# Altium project 8x8 Neopixel Matrix V2.PrjPcb
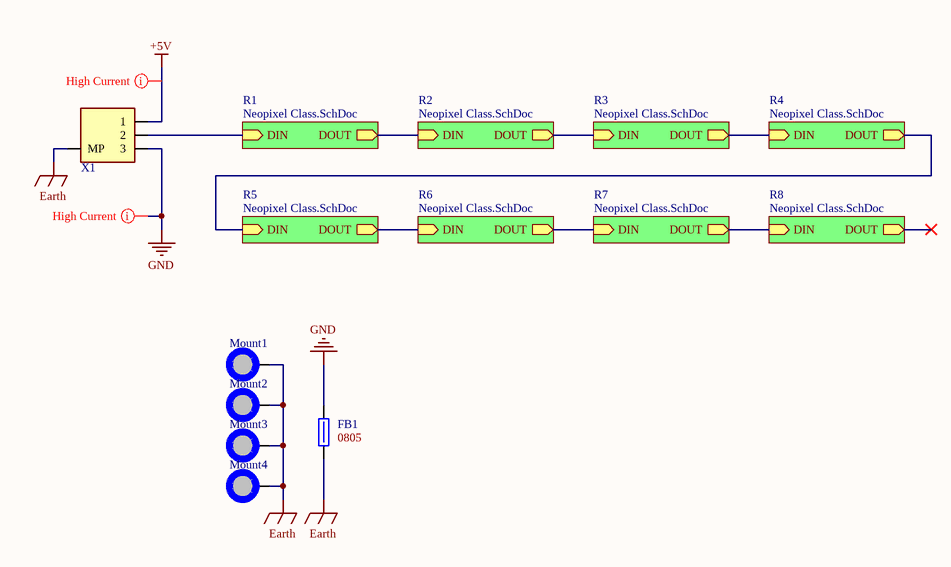
[diagram p0: Parent Sheet.SchDoc]
2 sheets, 134 parts. Net scope: hierarchical (ports join the sheet entries above them; power ports are global).
Board file: Layout.PcbDoc
Sheets:
  Parent Sheet.SchDoc
    R1 = Neopixel Class.SchDoc
    R2 = Neopixel Class.SchDoc
    R3 = Neopixel Class.SchDoc
    R4 = Neopixel Class.SchDoc
    R5 = Neopixel Class.SchDoc
    R6 = Neopixel Class.SchDoc
    R7 = Neopixel Class.SchDoc
    R8 = Neopixel Class.SchDoc

## Sheet Parent Sheet.SchDoc
size B; SheetNumber: 1; SheetTotal: 2

### Parts
FB1  Size Package: 0805  [[Ferrite] SMD 0805]  (hidden comment: 652-MH2029-300Y)
Mount1  M3 Mount Hole  [[Mount] M3 Mount Hole]  (value not drawn)  (no BOM)
Mount2  M3 Mount Hole  [[Mount] M3 Mount Hole]  (value not drawn)  (no BOM)
Mount3  M3 Mount Hole  [[Mount] M3 Mount Hole]  (value not drawn)  (no BOM)
Mount4  M3 Mount Hole  [[Mount] M3 Mount Hole]  (value not drawn)  (no BOM)
X1  [Pheonix] 3pin 2.5mm pitch  [[Pheonix] 3pin 2.5mm pitch]  (value not drawn)

### Sub-sheets
R1 = Neopixel Class.SchDoc: DIN (in), DOUT (out)
R2 = Neopixel Class.SchDoc: DIN (in), DOUT (out)
R3 = Neopixel Class.SchDoc: DIN (in), DOUT (out)
R4 = Neopixel Class.SchDoc: DIN (in), DOUT (out)
R5 = Neopixel Class.SchDoc: DIN (in), DOUT (out)
R6 = Neopixel Class.SchDoc: DIN (in), DOUT (out)
R7 = Neopixel Class.SchDoc: DIN (in), DOUT (out)
R8 = Neopixel Class.SchDoc: DIN (in), DOUT (out)

### Nets
+5V: X1.1
Earth: FB1.1 Mount1.1 Mount2.1 Mount3.1 Mount4.1 X1.MP
GND: FB1.2 X1.3
NetL1_R1_4: X1.2 ; sheet R1/DIN
NetL1_R2_4: sheet R1/DOUT, sheet R2/DIN
NetL1_R3_4: sheet R2/DOUT, sheet R3/DIN
NetL1_R4_4: sheet R3/DOUT, sheet R4/DIN
NetL1_R5_4: sheet R4/DOUT, sheet R5/DIN
NetL1_R6_4: sheet R5/DOUT, sheet R6/DIN
NetL1_R7_4: sheet R6/DOUT, sheet R7/DIN
NetL1_R8_4: sheet R7/DOUT, sheet R8/DIN

### Layout directives
net class High_Current_Nets: +5V, GND

### Library data of the parts
FB1 = [Ferrite] SMD 0805 3A 30ohm: Res @ Freq: 30 @ 100MHz; Supplier 1: DigiKey; Supplier Part Number 1: MH2029-300YCT-ND
Mount1-Mount4 = [Mount] M3 Mount Hole: Place at least 4.5mm from board edge. Plated.
X1 = [Pheonix] 3pin 2.5mm pitch: 1778777; Supplier 1: DigiKey; Supplier Part Number 1: 277-2316-1-ND

## Sheet Neopixel Class.SchDoc
size A; SheetNumber: 2; SheetTotal: 2
Used 8 times, as channels R1, R2, R3, R4, R5, R6, R7, R8. Parts and nets are listed once, with the designators drawn on the sheet.
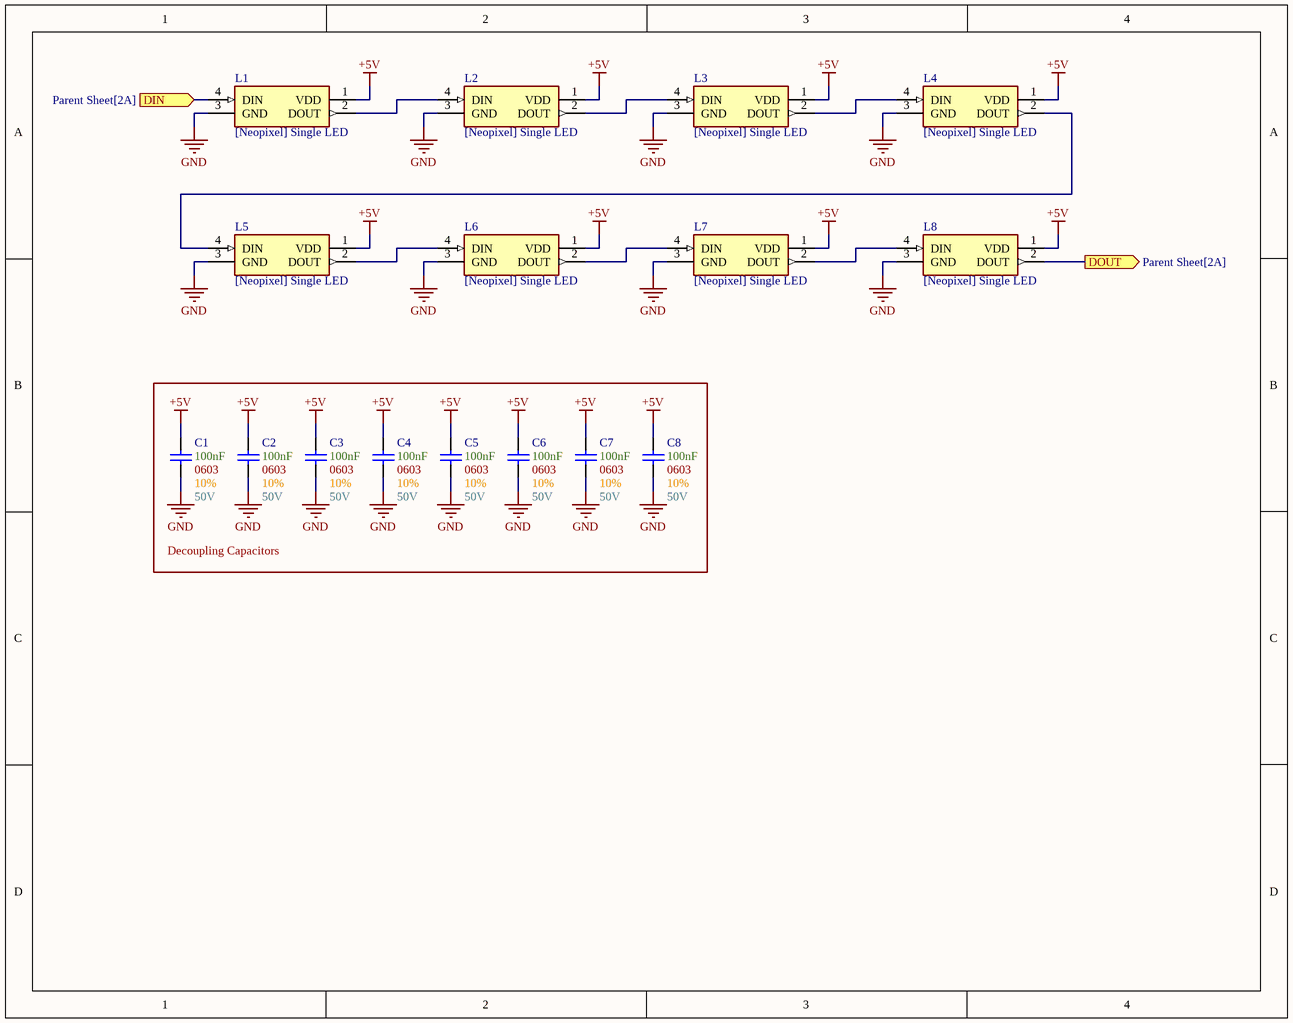
[diagram p1: Neopixel Class.SchDoc]

### Parts
C1  Max Voltage: 50V  Size Package: 0603  Tolerance: 10%  Capacitance: 100nF  [[Cap] SMD 0603]  (hidden comment: [Cap] 0603 0.1uF 10% 50V)
C2  Max Voltage: 50V  Size Package: 0603  Tolerance: 10%  Capacitance: 100nF  [[Cap] SMD 0603]  (hidden comment: [Cap] 0603 0.1uF 10% 50V)
C3  Max Voltage: 50V  Size Package: 0603  Tolerance: 10%  Capacitance: 100nF  [[Cap] SMD 0603]  (hidden comment: [Cap] 0603 0.1uF 10% 50V)
C4  Max Voltage: 50V  Size Package: 0603  Tolerance: 10%  Capacitance: 100nF  [[Cap] SMD 0603]  (hidden comment: [Cap] 0603 0.1uF 10% 50V)
C5  Max Voltage: 50V  Size Package: 0603  Tolerance: 10%  Capacitance: 100nF  [[Cap] SMD 0603]  (hidden comment: [Cap] 0603 0.1uF 10% 50V)
C6  Max Voltage: 50V  Size Package: 0603  Tolerance: 10%  Capacitance: 100nF  [[Cap] SMD 0603]  (hidden comment: [Cap] 0603 0.1uF 10% 50V)
C7  Max Voltage: 50V  Size Package: 0603  Tolerance: 10%  Capacitance: 100nF  [[Cap] SMD 0603]  (hidden comment: [Cap] 0603 0.1uF 10% 50V)
C8  Max Voltage: 50V  Size Package: 0603  Tolerance: 10%  Capacitance: 100nF  [[Cap] SMD 0603]  (hidden comment: [Cap] 0603 0.1uF 10% 50V)
L1  [Neopixel] Single LED  [[Neopixel] Single LED]
L2  [Neopixel] Single LED  [[Neopixel] Single LED]
L3  [Neopixel] Single LED  [[Neopixel] Single LED]
L4  [Neopixel] Single LED  [[Neopixel] Single LED]
L5  [Neopixel] Single LED  [[Neopixel] Single LED]
L6  [Neopixel] Single LED  [[Neopixel] Single LED]
L7  [Neopixel] Single LED  [[Neopixel] Single LED]
L8  [Neopixel] Single LED  [[Neopixel] Single LED]

### Blocks framed on the sheet
Decoupling Capacitors: C1-C8

### Ports
DIN (in, see Parent Sheet[2A]), DOUT (out, see Parent Sheet[2A])

### Nets
+5V: C1.2 C2.2 C3.2 C4.2 C5.2 C6.2 C7.2 C8.2 L1.1(VDD) L2.1(VDD) L3.1(VDD) L4.1(VDD) L5.1(VDD) L6.1(VDD) L7.1(VDD) L8.1(VDD)
GND: C1.1 C2.1 C3.1 C4.1 C5.1 C6.1 C7.1 C8.1 L1.3(GND) L2.3(GND) L3.3(GND) L4.3(GND) L5.3(GND) L6.3(GND) L7.3(GND) L8.3(GND)
DIN: L1.4(DIN) ; port DIN
DOUT: L8.2(DOUT) ; port DOUT
NetL1_2: L1.2(DOUT) L2.4(DIN)
NetL2_2: L2.2(DOUT) L3.4(DIN)
NetL3_2: L3.2(DOUT) L4.4(DIN)
NetL4_2: L4.2(DOUT) L5.4(DIN)
NetL5_2: L5.2(DOUT) L6.4(DIN)
NetL6_2: L6.2(DOUT) L7.4(DIN)
NetL7_2: L7.2(DOUT) L8.4(DIN)

### Channels
R1: designators end in _R1; ports DIN=NetL1_R1_4 DOUT=NetL1_R2_4
R2: designators end in _R2; ports DIN=NetL1_R2_4 DOUT=NetL1_R3_4
R3: designators end in _R3; ports DIN=NetL1_R3_4 DOUT=NetL1_R4_4
R4: designators end in _R4; ports DIN=NetL1_R4_4 DOUT=NetL1_R5_4
R5: designators end in _R5; ports DIN=NetL1_R5_4 DOUT=NetL1_R6_4
R6: designators end in _R6; ports DIN=NetL1_R6_4 DOUT=NetL1_R7_4
R7: designators end in _R7; ports DIN=NetL1_R7_4 DOUT=NetL1_R8_4
R8: designators end in _R8; ports DIN=NetL1_R8_4 DOUT=NetL8_R8_2

### Library data of the parts
C1-C8 = [Cap] 0603 0.1uF 10% 50V: CL10B104KB8NNNC; Supplier 1: DigiKey; Supplier Part Number 1: 1276-1000-6-ND
L1-L8 = [Neopixel] Single LED: WS2812B; Supplier 1: DigiKey; Supplier Part Number 1: 1568-16347CT-ND

## Nets that join several sheets
+5V: Parent Sheet (X1.1), R1 (16 pins), R2 (16 pins), R3 (16 pins), R4 (16 pins), R5 (16 pins), R6 (16 pins), R7 (16 pins), R8 (16 pins)
GND: Parent Sheet (FB1.2 X1.3), R1 (16 pins), R2 (16 pins), R3 (16 pins), R4 (16 pins), R5 (16 pins), R6 (16 pins), R7 (16 pins), R8 (16 pins)
NetL1_R1_4: Parent Sheet (X1.2), R1 (L1_R1.4)
NetL1_R2_4: R1 (L8_R1.2), R2 (L1_R2.4)
NetL1_R3_4: R2 (L8_R2.2), R3 (L1_R3.4)
NetL1_R4_4: R3 (L8_R3.2), R4 (L1_R4.4)
NetL1_R5_4: R4 (L8_R4.2), R5 (L1_R5.4)
NetL1_R6_4: R5 (L8_R5.2), R6 (L1_R6.4)
NetL1_R7_4: R6 (L8_R6.2), R7 (L1_R7.4)
NetL1_R8_4: R7 (L8_R7.2), R8 (L1_R8.4)